# Altium schematic sheet IMU.SchDoc
size A4; SheetNumber: 10; SheetTotal: 18
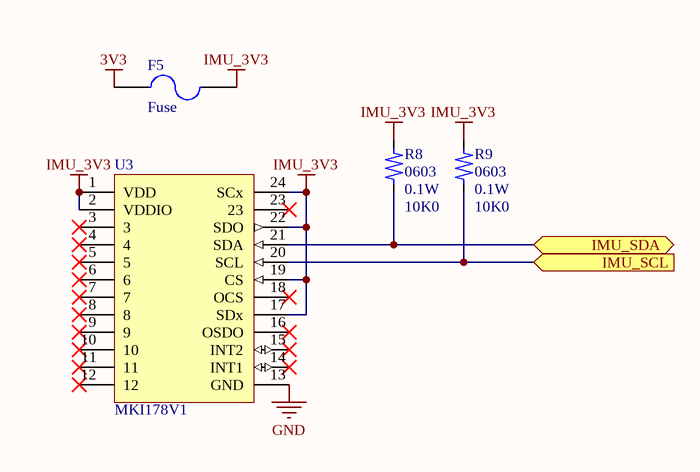
[diagram p0: IMU.SchDoc]

## Parts
F5  Fuse  [F_0603]
R8  0603  value 10K0  Rating: 0.1W  [R_0603]
R9  0603  value 10K0  Rating: 0.1W  [R_0603]
U3  MKI178V1  [FP_DIL24]

## Ports
IMU_SCL (in), IMU_SDA (bidir)

## Nets
3V3: F5.1
GND: U3.13(GND)
IMU_3V3: F5.2 R8.2(R2) R9.2(R2) U3.1(VDD) U3.2(VDDIO) U3.17(SDx) U3.19(CS) U3.22(SDO) U3.24(SCx)
IMU_SCL: R9.1(R1) U3.20(SCL) ; port IMU_SCL
IMU_SDA: R8.1(R1) U3.21(SDA) ; port IMU_SDA

Not connected (* = marked no-connect by the designer): U3 3* 4* 5* 6* 7* 8* 9* 10* 11* 12* 14(INT1)* 15(INT2)* 16(OSDO)* 18(OCS)* 23*

## Library data of the parts
F5 = Oth_MC06CF.500_F_0603: NI part number: 766324-01; Order number: 1841006; Rating: 32VDC; Type: Very Fast Acting Fuse; Value: 500mA; NI PEN/DEB: DEB; Distributor: Farnell; ID: Oth_MC06CF.500_F_0603; Link: http://hu.farnell.com/multicomp/mc06cf-500/fuse-smd-0603-0-5a/dp/1841006; Package: F_0603; Part Number: MC06CF.500; Price (HUF): 125
R8 R9 = CR-03FL7---10K: NI part number: 713771-01; Tolerance: 1%; ID: Res_0603_10K0_0.1W_Chip; NI PEN/DEB: DEB; Type: Chip Resistor; Part Number: CR-03FL7---10K; Order Number: 80-11-68; Distributor: Lomex; Link: http://lomex.hu/hu/webshop/#/page,0/search,80-11-68/stype,1/sidx,1; Price (HUF): 0.80; Package: 0603
U3 = MKI178V1: LSM6DSL inertial module adapter; Name: MKI178V1 LSM6DSL inertial module adapter; Reference: 511-STEVAL-MKI178V1; Supplier: Mouser